# Altium schematic sheet RPL_POWER_24V_REV3.SchDoc: Boost-Buck Controller +24DC/ 3A
size A; Date: Dec 17 2017; DrawnBy: Seyed Omid Hasanli; Revision: 4.0; SheetNumber: 1
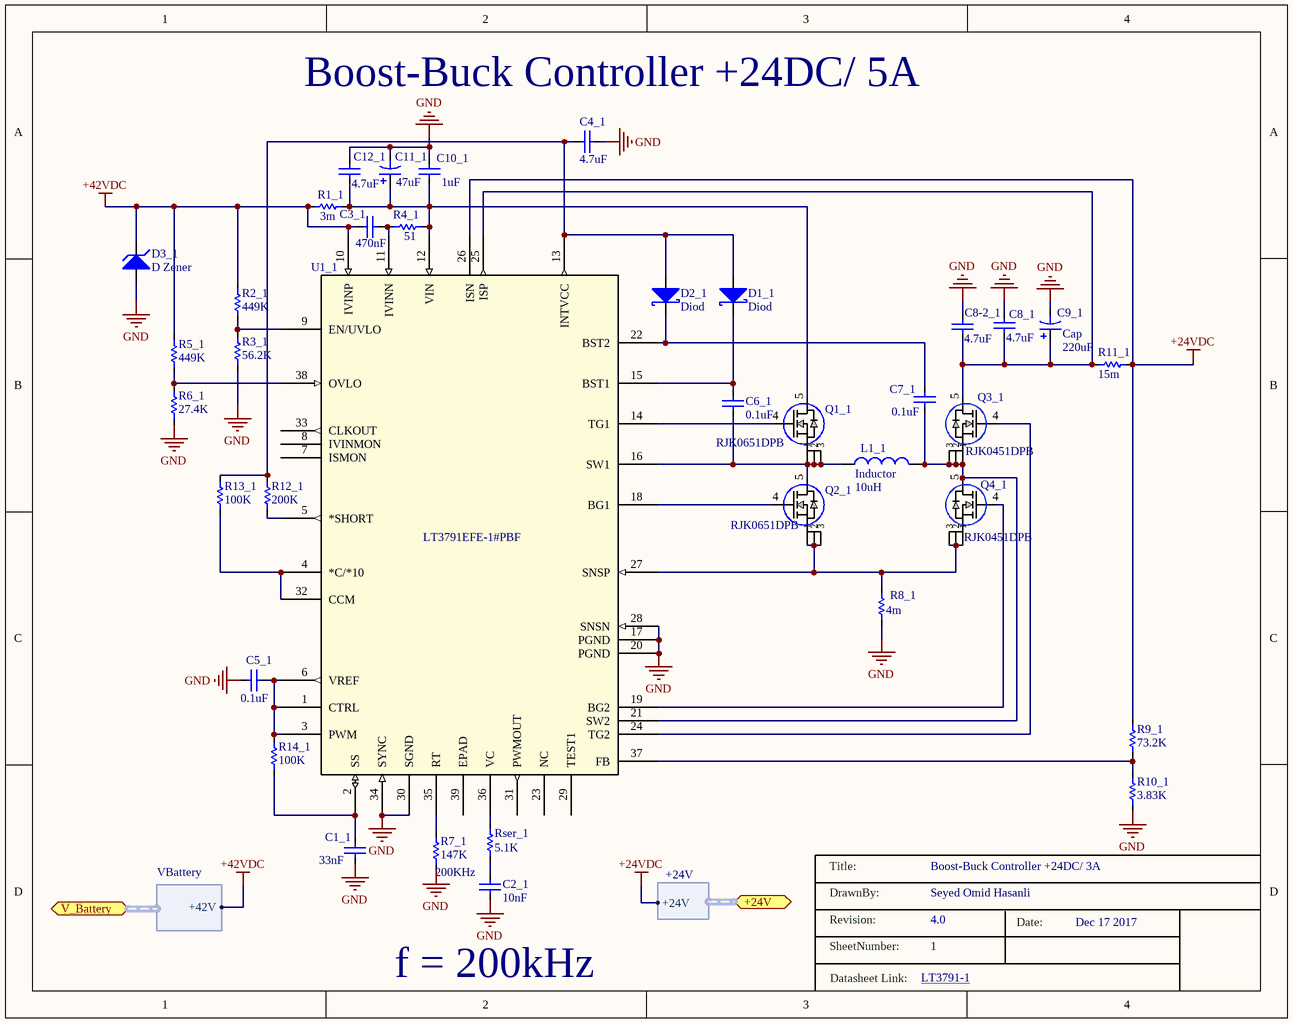
[diagram p0: RPL_POWER_24V_REV3.SchDoc]

## Parts
C1_1  value 33nF  [C1206C475K5PACTU]  (hidden comment: Cap)
C2_1  value 10nF  [C0805C475K9RACAUTO]  (hidden comment: Rser=5.1K)
C3_1  value 470nF  [C0805C475K9RACAUTO]  (hidden comment: Cap)
C4_1  value 4.7uF  [C0805C475K9RACAUTO]  (hidden comment: Cap)
C5_1  value 0.1uF  [C0805C475K9RACAUTO]  (hidden comment: Cap)
C6_1  value 0.1uF  [C0805C475K9RACAUTO]  (hidden comment: Cap)
C7_1  value 0.1uF  [C0805C475K9RACAUTO]  (hidden comment: Cap)
C8-2_1  value 4.7uF  [C1206C475K5PACTU]  (hidden comment: Cap)
C8_1  value 4.7uF  [C1206C475K5PACTU]  (hidden comment: Cap)
C9_1  Cap  value 220uF  [EEE_FK1V221AP]
C10_1  value 1uF  [C0805C475K9RACAUTO]  (hidden comment: Cap)
C11_1  value 47uF  [EEH_ZC1K470P]  (hidden comment: Cap)
C12_1  value 4.7uF  [C0805C475K9RACAUTO]  (hidden comment: Cap)
D1_1  Diod  [SODFL250X80-2N]
D2_1  Diod  [SODFL250X80-2N]
D3_1  D Zener  [SMAJ30A-TP]
L1_1  Inductor  value 10uH  [SER1360-103KLB]
Q1_1  RJK0651DPB  [LFPAK]
Q2_1  RJK0651DPB  [LFPAK]
Q3_1  RJK0451DPB  [LFPAK]
Q4_1  RJK0451DPB  [LFPAK]
R1_1  value 3m  [WSL12063L000FEA(1206)]  (hidden comment: Res)
R2_1  value 449K  [RES 0805]  (hidden comment: Res)
R3_1  value 56.2K  [RES 0805]  (hidden comment: Res)
R4_1  value 51  [RES 0805]  (hidden comment: Res)
R5_1  value 449K  [PTN1206E4993BBT1(1206)]  (hidden comment: Res)
R6_1  value 27.4K  [RES 0805]  (hidden comment: Res)
R7_1  200KHz  value 147K  [RES 0805]
R8_1  value 4m  [RES 0805]  (hidden comment: Res)
R9_1  value 73.2K  [RES 0805]  (hidden comment: Res)
R10_1  value 3.83K  [RES 0805]  (hidden comment: Res)
R11_1  value 15m  [WSL2010R0150FEA(2010)]  (hidden comment: Res)
R12_1  value 200K  [RES 0805]  (hidden comment: Res)
R13_1  value 100K  [RES 0805]  (hidden comment: Res)
R14_1  value 100K  [RES 0805]  (hidden comment: Res)
Rser_1  value 5.1K  [RES 0805]  (hidden comment: Res)
U1_1  LT3791EFE-1#PBF  [TSSOP-38_FE/AA]

## Ports
+24V (harness +24V), V_Battery (harness VBattery)

## Harnesses
VBattery: +42V
+24V: +24V

## Nets
+24VDC: R9_1.2 R11_1.2 U1_1.26(ISN) ; port +24V.+24V
+42VDC: C3_1.1 D3_1.2(K) R1_1.1 R2_1.2 R5_1.2 U1_1.10(IVINP) ; port V_Battery.+42V
GND: C1_1.1 C2_1.1 C4_1.1 C5_1.1 C8-2_1.2 C8_1.2 C9_1.2 C10_1.2 C11_1.2 C12_1.2 D3_1.1(A) R3_1.1 R6_1.1 R7_1.1 R8_1.1 R10_1.1 U1_1.17(PGND) U1_1.20(PGND) U1_1.28(SNSN) U1_1.30(SGND) U1_1.34(SYNC)
NetC1_1_2: C1_1.2 R14_1.1 U1_1.2(SS)
NetC2_1_2: C2_1.2 Rser_1.1
NetC3_1_2: C3_1.2 R4_1.1 U1_1.11(IVINN)
NetC4_1_2: C4_1.2 D1_1.1(A) D2_1.1(A) R12_1.2 R13_1.2 U1_1.13(INTVCC)
NetC5_1_2: C5_1.2 R14_1.2 U1_1.1(CTRL) U1_1.3(PWM) U1_1.6(VREF)
NetC6_1_1: C6_1.1 L1_1.1 Q1_1.1 Q1_1.2 Q1_1.3 Q2_1.5 U1_1.16(SW1)
NetC6_1_2: C6_1.2 D1_1.2(K) U1_1.15(BST1)
NetC7_1_1: C7_1.1 L1_1.2 Q3_1.1 Q3_1.2 Q3_1.3 Q4_1.5 U1_1.21(SW2)
NetC7_1_2: C7_1.2 D2_1.2(K) U1_1.22(BST2)
NetC8-2_1_1: C8-2_1.1 C8_1.1 C9_1.1 Q3_1.5 R11_1.1 U1_1.25(ISP)
NetC10_1_1: C10_1.1 C11_1.1 C12_1.1 Q1_1.5 R1_1.2 R4_1.2 U1_1.12(VIN)
NetQ1_1_4: Q1_1.4 U1_1.14(TG1)
NetQ2_1_1: Q2_1.1 Q2_1.2 Q2_1.3 Q4_1.1 Q4_1.2 Q4_1.3 R8_1.2 U1_1.27(SNSP)
NetQ2_1_4: Q2_1.4 U1_1.18(BG1)
NetQ3_1_4: Q3_1.4 U1_1.24(TG2)
NetQ4_1_4: Q4_1.4 U1_1.19(BG2)
NetR2_1_1: R2_1.1 R3_1.2 U1_1.9(EN/UVLO)
NetR5_1_1: R5_1.1 R6_1.2 U1_1.38(OVLO)
NetR7_1_2: R7_1.2 U1_1.35(RT)
NetR9_1_1: R9_1.1 R10_1.2 U1_1.37(FB)
NetR12_1_1: R12_1.1 U1_1.5(*SHORT)
NetR13_1_1: R13_1.1 U1_1.4(*C/*10) U1_1.32(CCM)
NetRser_1_2: Rser_1.2 U1_1.36(VC)

Not connected (* = marked no-connect by the designer): U1_1 7(ISMON) 8(IVINMON) 23(NC) 29(TEST1) 31(PWMOUT) 33(CLKOUT) 39(EPAD)

## Notes on the sheet
- Boost-Buck Controller +24DC/ 5A
- (near C2_1) f = 200kHz
- LT3791-1 <http://cds.linear.com/docs/en/datasheet/37911fb.pdf>
- Title:
- DrawnBy:
- Revision:
- SheetNumber:
- Date:
- Datasheet Link:

## Library data of the parts
C2_1 = Cap
C9_1 C11_1 = Cap Elec
D3_1 = D Zener: Zener Diode; Published: 8-Jun-2000; LatestRevisionDate: 17-Jul-2002; LatestRevisionNote: Re-released for DXP Platform.; PackageReference: DIODE-0.7; Publisher: Altium Limited; PackageDescription: Diode, Thru-Hole; 2 Leads; 0.7 in Pin Spacing
Q1_1 Q2_1 = RJK0651DPB-00#J5: Imported; Vendor: Renesas; VDSS_(V): 60; VGSS_(V): +/-20; ID_(A)@25C: 25; Pch(W): 45; Rds(on)@VGS: 10V,[8.0V]Max=14; QGD_(nC): 3.7; QG_(nC): 15; RG_(?): 0.7; Manufacturer_Part_Number: RJK0651DPB-00#J5; DatasheetLink: http://www.renesas.com/request?SCREEN_ID=ViewDocumentSearch&EXECUTE_ACTION=search&KEY_WORD=RJK0651DPB-00#J5; PartType: MOSFET MV; Package: LFPAK; Manufacturer_Name: Renesas; Value: Value
Q3_1 Q4_1 = RJK0451DPB-00#J5: Imported; Vendor: Renesas; VDSS_(V): 40; VGSS_(V): +/-20; ID_(A)@25C: 35; Pch(W): 45; Rds(on)@VGS: 10V,[8.0V]Max=7; QGD_(nC): 3; QG_(nC): 14; RG_(?): 0.7; Manufacturer_Part_Number: RJK0451DPB-00#J5; DatasheetLink: http://www.renesas.com/request?SCREEN_ID=ViewDocumentSearch&EXECUTE_ACTION=search&KEY_WORD=RJK0451DPB-00#J5; PartType: MOSFET MV; Package: LFPAK; Manufacturer_Name: Renesas; Value: Value
R7_1 = Res
U1_1 = LT3791EFE-1#PBF: Imported; Vendor: Linear Technology; Manufacturer_Part_Number: lt3791efe-1#pbf; Value: Value; Type: Type; RefDes: RefDes